# EAGLE schematic laserboard (EAGLE 9.6.2)
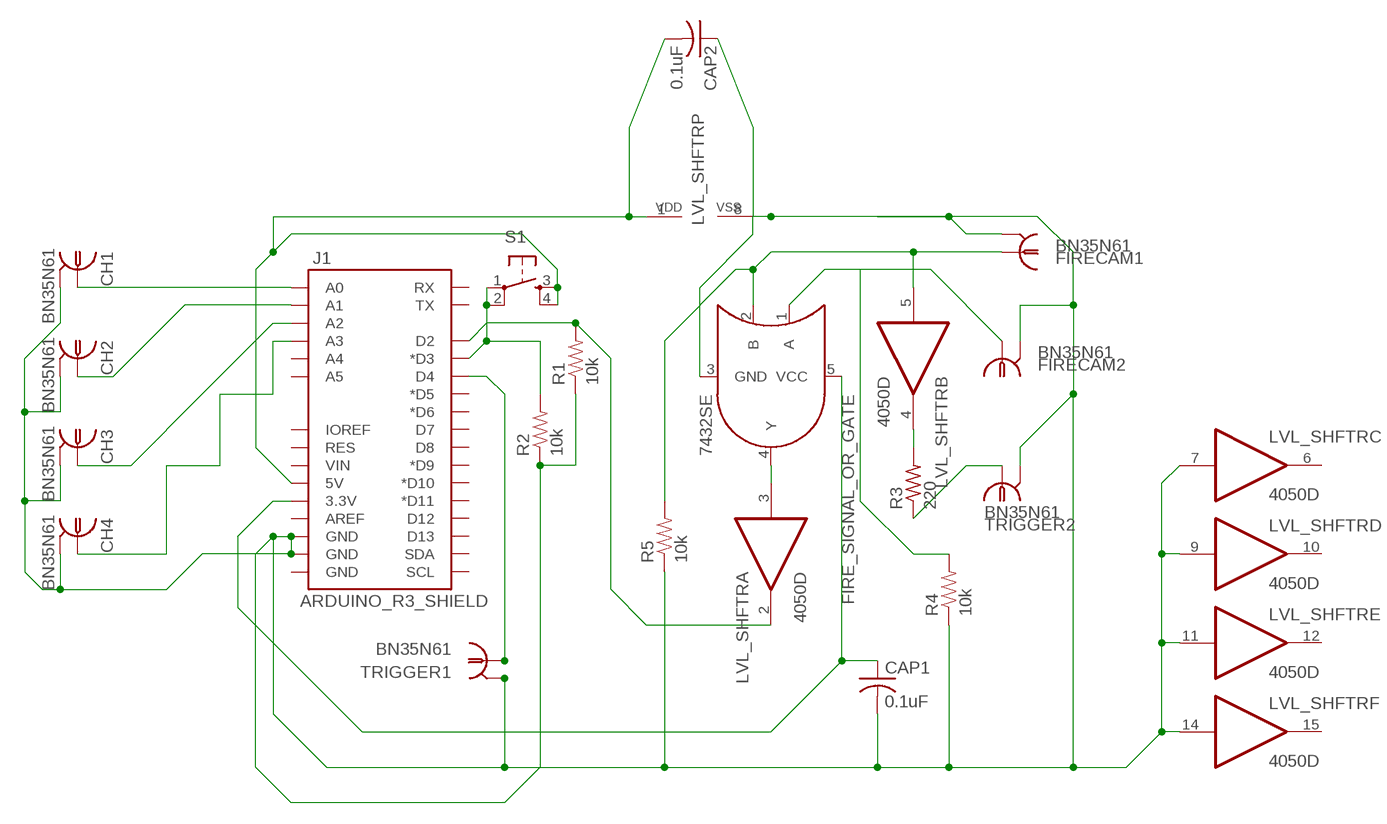
[diagram p0: schematic, sheet 1]

## Parts
CAP1  0.1uF  C-USC1206  [C1206]
CAP2  0.1uF  C-USC1206  [C1206]
CH1  BN35N61  [B35N61]
CH2  BN35N61  [B35N61]
CH3  BN35N61  [B35N61]
CH4  BN35N61  [B35N61]
FIRE_SIGNAL_OR_GATE  7432SE  [SOT353]
FIRECAM1  BN35N61  [B35N61]
FIRECAM2  BN35N61  [B35N61]
J1  ARDUINO_R3_SHIELD  [UNO_R3_SHIELD]
LVL_SHFTR  4050D  [SO16]
R1  10k  RESISTOR1206  [1206]
R2  10k  RESISTOR1206  [1206]
R3  220  R-US_M1206  [M1206]
R4  10k  RESISTOR1206  [1206]
R5  10k  RESISTOR1206  [1206]
S1  TAC_SWITCHPTH  [TACTILE-PTH]
TRIGGER1  BN35N61  [B35N61]
TRIGGER2  BN35N61  [B35N61]

## Nets
GND: CAP1.2 CAP2.1 CH1.2 CH1.3 CH1.4 CH1.5 CH2.2 CH2.3 CH2.4 CH2.5 CH3.2 CH3.3 CH3.4 CH3.5 CH4.2 CH4.3 CH4.4 CH4.5 FIRE_SIGNAL_OR_GATE.3(GND) FIRECAM1.2 FIRECAM1.3 FIRECAM1.4 FIRECAM1.5 FIRECAM2.2 FIRECAM2.3 FIRECAM2.4 FIRECAM2.5 J1.GND@1(GND) J1.GND@2(GND) LVL_SHFTR.7(C:I) LVL_SHFTR.8(P:VSS) LVL_SHFTR.9(D:I) LVL_SHFTR.11(E:I) LVL_SHFTR.14(F:I) R1.1 R2.1 R4.1 R5.1 TRIGGER1.2 TRIGGER1.3 TRIGGER1.4 TRIGGER1.5 TRIGGER2.2 TRIGGER2.3 TRIGGER2.4 TRIGGER2.5
N$1: CAP1.1 FIRE_SIGNAL_OR_GATE.5(VCC) J1.3.3V
N$2: CAP2.2 J1.5V LVL_SHFTR.1(P:VDD) S1.3 S1.4
N$3: CH1.1 J1.A0
N$4: CH2.1 J1.A1
N$5: CH3.1 J1.A2
N$7: CH4.1 J1.A3
N$10: FIRE_SIGNAL_OR_GATE.4(Y) LVL_SHFTR.3(A:I)
N$11: R3.1 TRIGGER2.1
N$13: J1.D3(*D3) R2.2 S1.1 S1.2
N$15: LVL_SHFTR.4(B:O) R3.2
N$17: J1.D2 LVL_SHFTR.2(A:O) R1.2
N$19: J1.D4 TRIGGER1.1
N$26: FIRE_SIGNAL_OR_GATE.1(A) FIRECAM2.1 R4.2
SLAVEFIRE: FIRE_SIGNAL_OR_GATE.2(B) FIRECAM1.1 LVL_SHFTR.5(B:I) R5.2
Unconnected: J1.A4 J1.A5 J1.AREF J1.D5(*D5) J1.D6(*D6) J1.D7 J1.D8 J1.D9(*D9) J1.D10(*D10) J1.D11(*D11) J1.D12 J1.D13 J1.GND@0(GND) J1.IOREF J1.RES J1.RX J1.SCL J1.SDA J1.TX J1.VIN LVL_SHFTR.6(C:O) LVL_SHFTR.10(D:O) LVL_SHFTR.12(E:O) LVL_SHFTR.15(F:O)

## Library data of the parts
CAP1 CAP2 = rcl:C-US: CAPACITOR, American symbol; SPICEPREFIX: C
CH1-CH4 FIRECAM1 FIRECAM2 TRIGGER1 TRIGGER2 = con-coax:BN35N61: BNC CONNECTOR M/A COM www.macom.com distributor Farnell 149-452; OC_FARNELL: unknown; OC_NEWARK: unknown
FIRE_SIGNAL_OR_GATE = SparkFun-DigitalIC:74*32: Single 2-input OR gate; PROD_ID: IC-10842
J1 = SparkFun-Boards:ARDUINO_R3_SHIELD: Shield form compatible with the Arduino Uno R3.
LVL_SHFTR = 40xx:4050: Hex non-inverting BUFFER
R1 R4 R5 = SparkFun-Resistors:RESISTOR: Resistor Basic schematic elements and footprints for 0603, 1206, and PTH resistors.
R2 = SparkFun-Passives:RESISTOR: Resistor Basic schematic elements and footprints for 0603, 1206, and PTH resistors.
R3 = resistor:R-US_: RESISTOR, American symbol
S1 = SparkFun-Retired:TAC_SWITCH: Momentary Switch Button commonly used for reset or general input. Spark Fun Electronics SKU : COM-00097 SMT- SWCH-08247